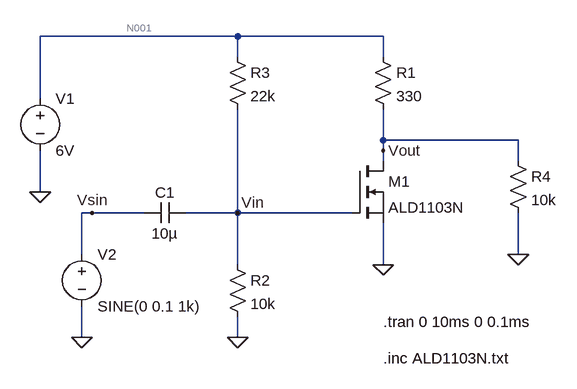
[diagram p0: schematic exp2.asc]
exp2.asc, the LTspice schematic file:
Version 4.1
SHEET 1 912 680
WIRE 192 -128 -112 -128
WIRE 416 -128 192 -128
WIRE 192 -96 192 -128
WIRE 416 -96 416 -128
WIRE -112 -32 -112 -128
WIRE 416 32 416 -16
WIRE 624 32 416 32
WIRE 416 48 416 32
WIRE 416 64 416 48
WIRE 624 64 624 32
WIRE -112 112 -112 48
WIRE -32 144 -48 144
WIRE 48 144 -32 144
WIRE 192 144 192 -16
WIRE 192 144 112 144
WIRE 368 144 192 144
WIRE -48 208 -48 144
WIRE 624 208 624 144
WIRE 192 224 192 144
WIRE 416 224 416 160
WIRE -48 336 -48 288
WIRE 192 336 192 304
FLAG -48 336 0
FLAG 192 336 0
FLAG -112 112 0
FLAG 416 224 0
FLAG 416 48 Vout
FLAG 192 144 Vin
FLAG -32 144 Vsin
FLAG 624 208 0
SYMBOL voltage -112 -48 R0
WINDOW 123 0 0 Left 0
WINDOW 39 0 0 Left 0
SYMATTR InstName V1
SYMATTR Value 6V
SYMBOL voltage -48 192 R0
WINDOW 123 0 0 Left 0
WINDOW 39 0 0 Left 0
SYMATTR InstName V2
SYMATTR Value SINE(0 0.1 1k)
SYMBOL cap 112 128 R90
WINDOW 0 0 32 VBottom 2
WINDOW 3 32 32 VTop 2
SYMATTR InstName C1
SYMATTR Value 10µ
SYMBOL res 400 -112 R0
SYMATTR InstName R1
SYMATTR Value 330
SYMBOL res 176 208 R0
SYMATTR InstName R2
SYMATTR Value 10k
SYMBOL res 176 -112 R0
SYMATTR InstName R3
SYMATTR Value 22k
SYMBOL nmos 368 64 R0
SYMATTR InstName M1
SYMATTR Value ALD1103N
SYMBOL res 608 48 R0
SYMATTR InstName R4
SYMATTR Value 10k
TEXT 416 368 Left 2 !.inc ALD1103N.txt
TEXT 416 312 Left 2 !.tran 0 10ms 0 0.1ms

The netlist it stands for:
* exp2.asc
V1 N001 0 6V
V2 Vsin 0 SINE(0 0.1 1k)
C1 Vin Vsin 10µ
R1 N001 Vout 330
R2 Vin 0 10k
R3 N001 Vin 22k
M1 Vout Vin 0 0 ALD1103N
R4 Vout 0 10k
.model NMOS NMOS
.model PMOS PMOS
.lib standard.mos
.inc ALD1103N.txt
.tran 0 10ms 0 0.1ms
.backanno
.end

* Results of the author's LTspice run, read from the files saved beside the schematic
* Operating Point, zero values left out:
*   V(vout) = 4.183 V
*   V(n001) = 6 V
*   V(vin) = 1.875 V
*   I(V1) = -5.693 mA
*   I(R2) = 187.5 µA
*   I(R3) = 187.5 µA
*   I(R4) = 418.3 µA
*   Id(M1) = 5.087 mA
*   Is(M1) = -5.087 mA
*   Ib(M1) = -4.194 pA
*   I(R1) = 5.506 mA
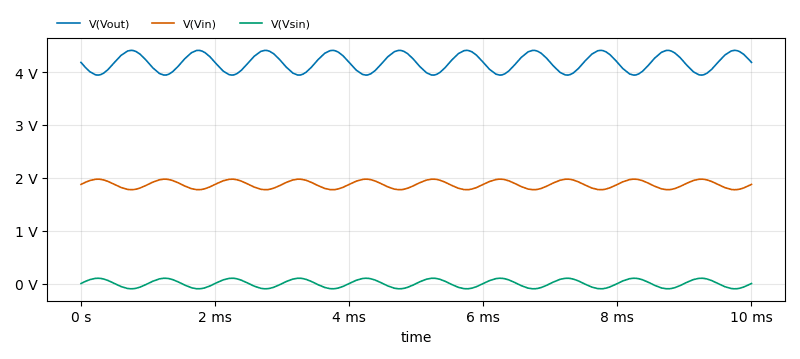
[diagram p1: Transient Analysis of exp2.asc, plotted from the saved traces]
* Transient Analysis, 1 run:
*   V(Vout): min 3.943 V, max 4.411 V, average 4.18 V, rms 4.184 V, last 4.183 V
*   V(Vin): min 1.775 V, max 1.975 V, average 1.875 V, rms 1.876 V, last 1.875 V
*   V(Vsin): min -100 mV, max 100 mV, average 11.6 µV, rms 71.65 mV, last 0 V